# Altium schematic sheet Main.SchDoc
size A4
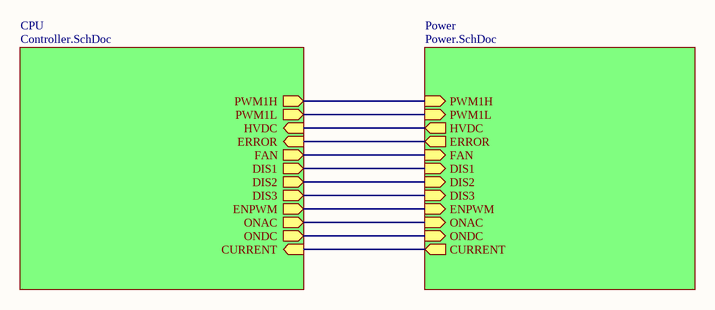
[diagram p0: Main.SchDoc]

## Sub-sheets
CPU = Controller.SchDoc: PWM1H (out), PWM1L (out), HVDC (in), ERROR (in), FAN (out), DIS3 (out), DIS1 (out), DIS2 (out), ENPWM (out), ONAC (out), ONDC (out), CURRENT (in)
Power = Power.SchDoc: ENPWM (in), ONAC (in), PWM1H (in), PWM1L (in), HVDC (out), ONDC (in), FAN (in), DIS1 (in), DIS2 (in), DIS3 (in), ERROR (out), CURRENT (out)

## Nets
(unnamed): sheet CPU/PWM1H, sheet Power/PWM1H
(unnamed): sheet CPU/PWM1L, sheet Power/PWM1L
(unnamed): sheet CPU/HVDC, sheet Power/HVDC
(unnamed): sheet CPU/ERROR, sheet Power/ERROR
(unnamed): sheet CPU/FAN, sheet Power/FAN
(unnamed): sheet CPU/DIS3, sheet Power/DIS3
(unnamed): sheet CPU/DIS1, sheet Power/DIS1
(unnamed): sheet CPU/DIS2, sheet Power/DIS2
(unnamed): sheet CPU/ENPWM, sheet Power/ENPWM
(unnamed): sheet CPU/ONAC, sheet Power/ONAC
(unnamed): sheet CPU/ONDC, sheet Power/ONDC
(unnamed): sheet CPU/CURRENT, sheet Power/CURRENT